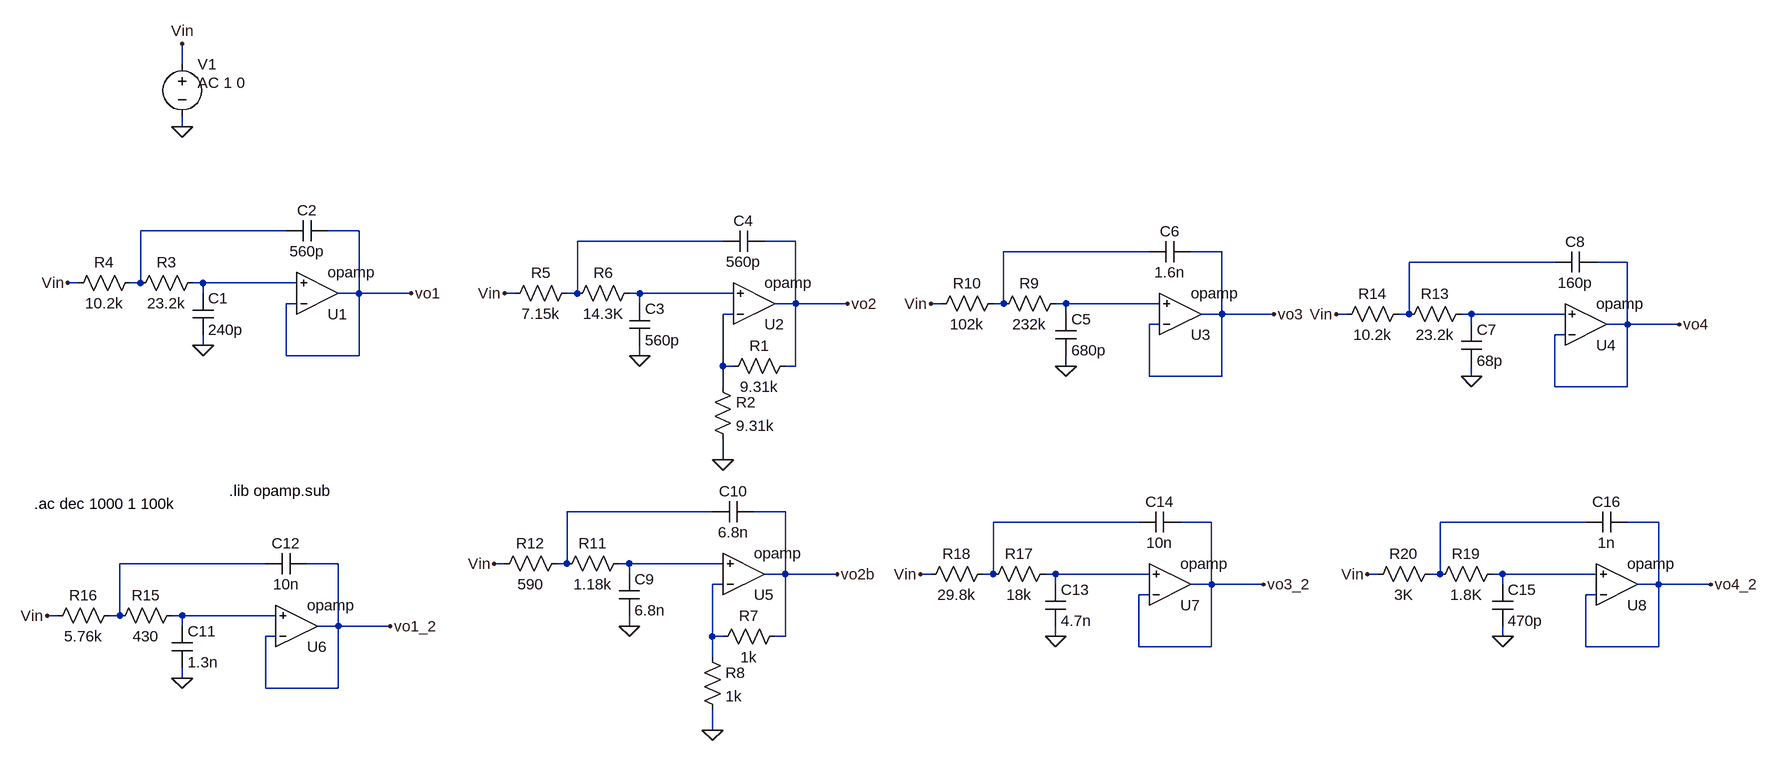
[diagram p0: schematic Draft2.asc]
Draft2.asc, the LTspice schematic file:
Version 4
SHEET 1 2488 836
WIRE 48 -208 48 -240
WIRE 48 -112 48 -128
WIRE 208 48 -16 48
WIRE 320 48 272 48
WIRE 880 64 656 64
WIRE 992 64 944 64
WIRE 1536 80 1312 80
WIRE 1648 80 1600 80
WIRE 2160 96 1936 96
WIRE 2272 96 2224 96
WIRE -112 128 -128 128
WIRE -16 128 -16 48
WIRE -16 128 -32 128
WIRE 80 128 64 128
WIRE 224 128 80 128
WIRE 80 144 80 128
WIRE 320 144 320 48
WIRE 320 144 288 144
WIRE 400 144 320 144
WIRE 560 144 544 144
WIRE 656 144 656 64
WIRE 656 144 640 144
WIRE 752 144 736 144
WIRE 896 144 752 144
WIRE 224 160 208 160
WIRE 752 160 752 144
WIRE 992 160 992 64
WIRE 992 160 960 160
WIRE 1072 160 992 160
WIRE 1216 160 1200 160
WIRE 1312 160 1312 80
WIRE 1312 160 1296 160
WIRE 1408 160 1392 160
WIRE 1552 160 1408 160
WIRE 896 176 880 176
WIRE 1408 176 1408 160
WIRE 1648 176 1648 80
WIRE 1648 176 1616 176
WIRE 1728 176 1648 176
WIRE 1840 176 1824 176
WIRE 1936 176 1936 96
WIRE 1936 176 1920 176
WIRE 2032 176 2016 176
WIRE 2176 176 2032 176
WIRE 1552 192 1536 192
WIRE 2032 192 2032 176
WIRE 2272 192 2272 96
WIRE 2272 192 2240 192
WIRE 2352 192 2272 192
WIRE 2176 208 2160 208
WIRE 80 224 80 208
WIRE 208 240 208 160
WIRE 320 240 320 144
WIRE 320 240 208 240
WIRE 752 240 752 224
WIRE 880 256 880 176
WIRE 896 256 880 256
WIRE 992 256 992 160
WIRE 992 256 976 256
WIRE 1408 256 1408 240
WIRE 1536 272 1536 192
WIRE 1648 272 1648 176
WIRE 1648 272 1536 272
WIRE 2032 272 2032 256
WIRE 880 288 880 256
WIRE 2160 288 2160 208
WIRE 2272 288 2272 192
WIRE 2272 288 2160 288
WIRE 880 400 880 368
WIRE 864 480 640 480
WIRE 976 480 928 480
WIRE 1520 496 1296 496
WIRE 1632 496 1584 496
WIRE 2208 496 1984 496
WIRE 2320 496 2272 496
WIRE 176 560 -48 560
WIRE 288 560 240 560
WIRE 544 560 528 560
WIRE 640 560 640 480
WIRE 640 560 624 560
WIRE 736 560 720 560
WIRE 880 560 736 560
WIRE 736 576 736 560
WIRE 976 576 976 480
WIRE 976 576 944 576
WIRE 1056 576 976 576
WIRE 1200 576 1184 576
WIRE 1296 576 1296 496
WIRE 1296 576 1280 576
WIRE 1392 576 1376 576
WIRE 1536 576 1392 576
WIRE 1888 576 1872 576
WIRE 1984 576 1984 496
WIRE 1984 576 1968 576
WIRE 2080 576 2064 576
WIRE 2224 576 2080 576
WIRE 880 592 864 592
WIRE 1392 592 1392 576
WIRE 1632 592 1632 496
WIRE 1632 592 1600 592
WIRE 1712 592 1632 592
WIRE 2080 592 2080 576
WIRE 2320 592 2320 496
WIRE 2320 592 2288 592
WIRE 2400 592 2320 592
WIRE 1536 608 1520 608
WIRE 2224 608 2208 608
WIRE -144 640 -160 640
WIRE -48 640 -48 560
WIRE -48 640 -64 640
WIRE 48 640 32 640
WIRE 192 640 48 640
WIRE 48 656 48 640
WIRE 288 656 288 560
WIRE 288 656 256 656
WIRE 368 656 288 656
WIRE 736 656 736 640
WIRE 192 672 176 672
WIRE 864 672 864 592
WIRE 880 672 864 672
WIRE 976 672 976 576
WIRE 976 672 960 672
WIRE 1392 672 1392 656
WIRE 2080 672 2080 656
WIRE 1520 688 1520 608
WIRE 1632 688 1632 592
WIRE 1632 688 1520 688
WIRE 2208 688 2208 608
WIRE 2320 688 2320 592
WIRE 2320 688 2208 688
WIRE 864 704 864 672
WIRE 48 736 48 720
WIRE 176 752 176 672
WIRE 288 752 288 656
WIRE 288 752 176 752
WIRE 864 816 864 784
FLAG 80 224 0
FLAG -128 128 Vin
FLAG 400 144 vo1
FLAG 752 240 0
FLAG 544 144 Vin
FLAG 1072 160 vo2
FLAG 880 400 0
FLAG 1408 256 0
FLAG 1200 160 Vin
FLAG 1728 176 vo3
FLAG 2032 272 0
FLAG 1824 176 Vin
FLAG 2352 192 vo4
FLAG 48 -112 0
FLAG 48 -240 Vin
FLAG 736 656 0
FLAG 528 560 Vin
FLAG 1056 576 vo2b
FLAG 864 816 0
FLAG 48 736 0
FLAG -160 640 Vin
FLAG 368 656 vo1_2
FLAG 1392 672 0
FLAG 1184 576 Vin
FLAG 1712 592 vo3_2
FLAG 2080 672 0
FLAG 1872 576 Vin
FLAG 2400 592 vo4_2
SYMBOL OpAmps\\opamp 256 208 M180
SYMATTR InstName U1
SYMBOL res 992 240 R90
WINDOW 0 0 56 VBottom 2
WINDOW 3 32 56 VTop 2
SYMATTR InstName R1
SYMATTR Value 9.31k
SYMBOL res 864 272 R0
SYMATTR InstName R2
SYMATTR Value 9.31k
SYMBOL cap 64 144 R0
SYMATTR InstName C1
SYMATTR Value 240p
SYMBOL res 80 112 R90
WINDOW 0 0 56 VBottom 2
WINDOW 3 32 56 VTop 2
SYMATTR InstName R3
SYMATTR Value 23.2k
SYMBOL res -16 112 R90
WINDOW 0 0 56 VBottom 2
WINDOW 3 32 56 VTop 2
SYMATTR InstName R4
SYMATTR Value 10.2k
SYMBOL cap 272 32 R90
WINDOW 0 0 32 VBottom 2
WINDOW 3 32 32 VTop 2
SYMATTR InstName C2
SYMATTR Value 560p
SYMBOL OpAmps\\opamp 928 224 M180
SYMATTR InstName U2
SYMBOL cap 736 160 R0
SYMATTR InstName C3
SYMATTR Value 560p
SYMBOL res 752 128 R90
WINDOW 0 0 56 VBottom 2
WINDOW 3 32 56 VTop 2
SYMATTR InstName R6
SYMATTR Value 14.3K
SYMBOL res 656 128 R90
WINDOW 0 0 56 VBottom 2
WINDOW 3 32 56 VTop 2
SYMATTR InstName R5
SYMATTR Value 7.15k
SYMBOL cap 944 48 R90
WINDOW 0 0 32 VBottom 2
WINDOW 3 32 32 VTop 2
SYMATTR InstName C4
SYMATTR Value 560p
SYMBOL OpAmps\\opamp 1584 240 M180
SYMATTR InstName U3
SYMBOL cap 1392 176 R0
SYMATTR InstName C5
SYMATTR Value 680p
SYMBOL res 1408 144 R90
WINDOW 0 0 56 VBottom 2
WINDOW 3 32 56 VTop 2
SYMATTR InstName R9
SYMATTR Value 232k
SYMBOL res 1312 144 R90
WINDOW 0 0 56 VBottom 2
WINDOW 3 32 56 VTop 2
SYMATTR InstName R10
SYMATTR Value 102k
SYMBOL cap 1600 64 R90
WINDOW 0 0 32 VBottom 2
WINDOW 3 32 32 VTop 2
SYMATTR InstName C6
SYMATTR Value 1.6n
SYMBOL OpAmps\\opamp 2208 256 M180
SYMATTR InstName U4
SYMBOL cap 2016 192 R0
SYMATTR InstName C7
SYMATTR Value 68p
SYMBOL res 2032 160 R90
WINDOW 0 0 56 VBottom 2
WINDOW 3 32 56 VTop 2
SYMATTR InstName R13
SYMATTR Value 23.2k
SYMBOL res 1936 160 R90
WINDOW 0 0 56 VBottom 2
WINDOW 3 32 56 VTop 2
SYMATTR InstName R14
SYMATTR Value 10.2k
SYMBOL cap 2224 80 R90
WINDOW 0 0 32 VBottom 2
WINDOW 3 32 32 VTop 2
SYMATTR InstName C8
SYMATTR Value 160p
SYMBOL voltage 48 -224 R0
WINDOW 123 24 44 Left 2
WINDOW 39 0 0 Left 0
SYMATTR InstName V1
SYMATTR Value ""
SYMATTR Value2 AC 1 0
SYMBOL res 976 656 R90
WINDOW 0 0 56 VBottom 2
WINDOW 3 32 56 VTop 2
SYMATTR InstName R7
SYMATTR Value 1k
SYMBOL res 848 688 R0
SYMATTR InstName R8
SYMATTR Value 1k
SYMBOL OpAmps\\opamp 912 640 M180
SYMATTR InstName U5
SYMBOL cap 720 576 R0
SYMATTR InstName C9
SYMATTR Value 6.8n
SYMBOL res 736 544 R90
WINDOW 0 0 56 VBottom 2
WINDOW 3 32 56 VTop 2
SYMATTR InstName R11
SYMATTR Value 1.18k
SYMBOL res 640 544 R90
WINDOW 0 0 56 VBottom 2
WINDOW 3 32 56 VTop 2
SYMATTR InstName R12
SYMATTR Value 590
SYMBOL cap 928 464 R90
WINDOW 0 0 32 VBottom 2
WINDOW 3 32 32 VTop 2
SYMATTR InstName C10
SYMATTR Value 6.8n
SYMBOL OpAmps\\opamp 224 720 M180
SYMATTR InstName U6
SYMBOL cap 32 656 R0
SYMATTR InstName C11
SYMATTR Value 1.3n
SYMBOL res 48 624 R90
WINDOW 0 0 56 VBottom 2
WINDOW 3 32 56 VTop 2
SYMATTR InstName R15
SYMATTR Value 430
SYMBOL res -48 624 R90
WINDOW 0 0 56 VBottom 2
WINDOW 3 32 56 VTop 2
SYMATTR InstName R16
SYMATTR Value 5.76k
SYMBOL cap 240 544 R90
WINDOW 0 0 32 VBottom 2
WINDOW 3 32 32 VTop 2
SYMATTR InstName C12
SYMATTR Value 10n
SYMBOL OpAmps\\opamp 1568 656 M180
SYMATTR InstName U7
SYMBOL cap 1376 592 R0
SYMATTR InstName C13
SYMATTR Value 4.7n
SYMBOL res 1392 560 R90
WINDOW 0 0 56 VBottom 2
WINDOW 3 32 56 VTop 2
SYMATTR InstName R17
SYMATTR Value 18k
SYMBOL res 1296 560 R90
WINDOW 0 0 56 VBottom 2
WINDOW 3 32 56 VTop 2
SYMATTR InstName R18
SYMATTR Value 29.8k
SYMBOL cap 1584 480 R90
WINDOW 0 0 32 VBottom 2
WINDOW 3 32 32 VTop 2
SYMATTR InstName C14
SYMATTR Value 10n
SYMBOL OpAmps\\opamp 2256 656 M180
SYMATTR InstName U8
SYMBOL cap 2064 592 R0
SYMATTR InstName C15
SYMATTR Value 470p
SYMBOL res 2080 560 R90
WINDOW 0 0 56 VBottom 2
WINDOW 3 32 56 VTop 2
SYMATTR InstName R19
SYMATTR Value 1.8K
SYMBOL res 1984 560 R90
WINDOW 0 0 56 VBottom 2
WINDOW 3 32 56 VTop 2
SYMATTR InstName R20
SYMATTR Value 3K
SYMBOL cap 2272 480 R90
WINDOW 0 0 32 VBottom 2
WINDOW 3 32 32 VTop 2
SYMATTR InstName C16
SYMATTR Value 1n
TEXT 120 448 Left 2 !.lib opamp.sub
TEXT -180 468 Left 2 !.ac dec 1000 1 100k

The netlist it stands for:
* Draft2.asc
XU1 vo1 N005 vo1 opamp Aol=100K GBW=10Meg  ; pins invin noninvin out
R1 vo2 N008 9.31k
R2 N008 0 9.31k
C1 N005 0 240p
R3 N005 N001 23.2k
R4 N001 Vin 10.2k
C2 vo1 N001 560p
XU2 N008 N006 vo2 opamp Aol=100K GBW=10Meg  ; pins invin noninvin out
C3 N006 0 560p
R6 N006 N002 14.3K
R5 N002 Vin 7.15k
C4 vo2 N002 560p
XU3 vo3 N007 vo3 opamp Aol=100K GBW=10Meg  ; pins invin noninvin out
C5 N007 0 680p
R9 N007 N003 232k
R10 N003 Vin 102k
C6 vo3 N003 1.6n
XU4 vo4 N009 vo4 opamp Aol=100K GBW=10Meg  ; pins invin noninvin out
C7 N009 0 68p
R13 N009 N004 23.2k
R14 N004 Vin 10.2k
C8 vo4 N004 160p
V1 Vin 0 AC 1 0
R7 vo2b N017 1k
R8 N017 0 1k
XU5 N017 N014 vo2b opamp Aol=100K GBW=10Meg  ; pins invin noninvin out
C9 N014 0 6.8n
R11 N014 N010 1.18k
R12 N010 Vin 590
C10 vo2b N010 6.8n
XU6 vo1_2 N018 vo1_2 opamp Aol=100K GBW=10Meg  ; pins invin noninvin out
C11 N018 0 1.3n
R15 N018 N013 430
R16 N013 Vin 5.76k
C12 vo1_2 N013 10n
XU7 vo3_2 N015 vo3_2 opamp Aol=100K GBW=10Meg  ; pins invin noninvin out
C13 N015 0 4.7n
R17 N015 N011 18k
R18 N011 Vin 29.8k
C14 vo3_2 N011 10n
XU8 vo4_2 N016 vo4_2 opamp Aol=100K GBW=10Meg  ; pins invin noninvin out
C15 N016 0 470p
R19 N016 N012 1.8K
R20 N012 Vin 3K
C16 vo4_2 N012 1n
.lib opamp.sub
.ac dec 1000 1 100k
.backanno
.end

* Results of the author's LTspice run, read from the files saved beside the schematic
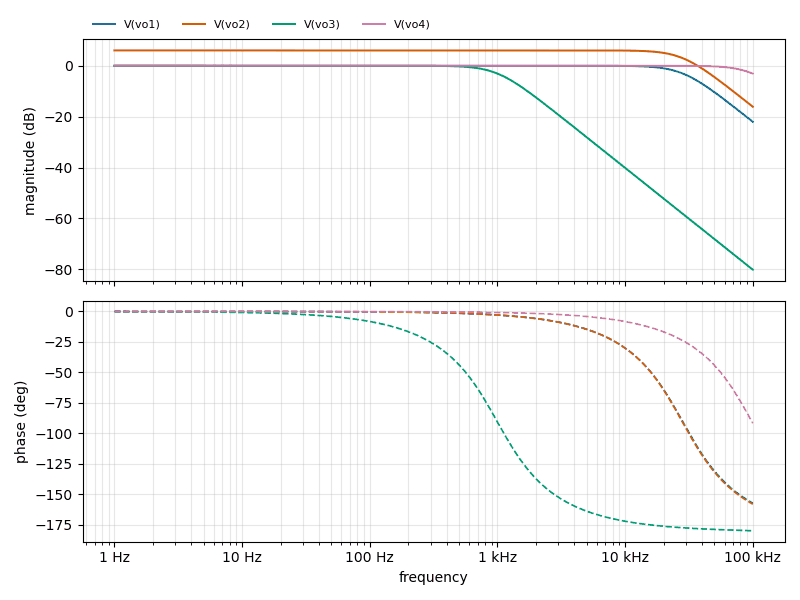
[diagram p1: AC Analysis of Draft2.asc, plotted from the saved traces]
* AC Analysis, 1 run:
*   V(vo1): -0.00 dB at 1 Hz, -22.03 dB at 100 kHz, peak -0.00 dB at 1 Hz, 3 dB below the peak at 28.08 kHz
*   V(vo2): 6.02 dB at 1 Hz, -16.12 dB at 100 kHz, peak 6.02 dB at 2.477 kHz, 3 dB below the peak at 28.1 kHz
*   V(vo3): -0.00 dB at 1 Hz, -80.14 dB at 100 kHz, peak -0.00 dB at 1 Hz, 3 dB below the peak at 991 Hz
*   V(vo4): -0.00 dB at 1 Hz, -3.09 dB at 100 kHz, peak 0.00 dB at 8.933 kHz, 3 dB below the peak at 99.08 kHz